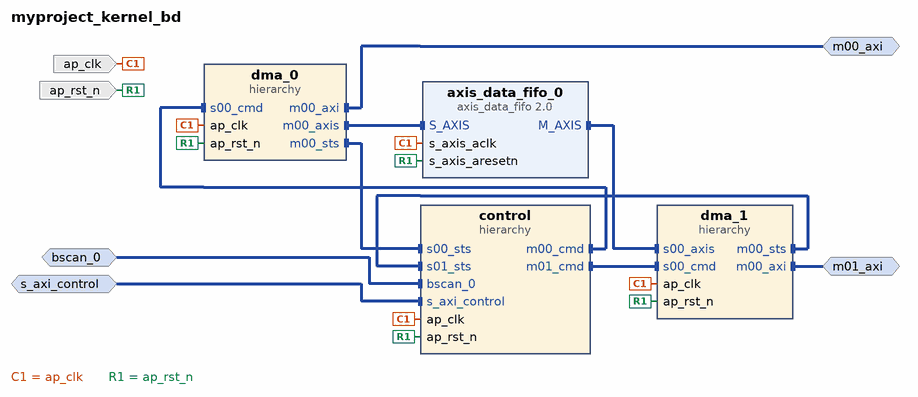
[diagram p0: block diagram of the top level]
# Vivado block design myproject_kernel_bd, xcu50-fsvh2104-2-e, Vivado 2020.1
create_bd_design myproject_kernel_bd

create_bd_intf_port -mode Slave -vlnv xilinx.com:interface:bscan_rtl:1.0 bscan_0
create_bd_intf_port -mode Master -vlnv xilinx.com:interface:aximm_rtl:1.0 m00_axi
set_property -dict [list \
  CONFIG.DATA_WIDTH 32 \
  CONFIG.PROTOCOL AXI4 \
  CONFIG.FREQ_HZ 250000000 \
  CONFIG.ADDR_WIDTH 64 \
  CONFIG.READ_WRITE_MODE READ_WRITE \
  CONFIG.HAS_BURST 0 \
  CONFIG.HAS_LOCK 0 \
  CONFIG.HAS_PROT 0 \
  CONFIG.HAS_CACHE 0 \
  CONFIG.HAS_QOS 0 \
  CONFIG.HAS_REGION 0 \
  CONFIG.HAS_WSTRB 1 \
  CONFIG.HAS_BRESP 0 \
  CONFIG.NUM_READ_OUTSTANDING 1 \
  CONFIG.NUM_WRITE_OUTSTANDING 1 \
] [get_bd_intf_ports m00_axi]
create_bd_intf_port -mode Master -vlnv xilinx.com:interface:aximm_rtl:1.0 m01_axi
set_property -dict [list \
  CONFIG.DATA_WIDTH 32 \
  CONFIG.PROTOCOL AXI4 \
  CONFIG.FREQ_HZ 250000000 \
  CONFIG.ADDR_WIDTH 64 \
  CONFIG.READ_WRITE_MODE READ_WRITE \
  CONFIG.HAS_BURST 0 \
  CONFIG.HAS_LOCK 0 \
  CONFIG.HAS_PROT 0 \
  CONFIG.HAS_CACHE 0 \
  CONFIG.HAS_QOS 0 \
  CONFIG.HAS_REGION 0 \
  CONFIG.HAS_WSTRB 1 \
  CONFIG.HAS_BRESP 0 \
  CONFIG.NUM_READ_OUTSTANDING 1 \
  CONFIG.NUM_WRITE_OUTSTANDING 1 \
] [get_bd_intf_ports m01_axi]
create_bd_intf_port -mode Slave -vlnv xilinx.com:interface:aximm_rtl:1.0 s_axi_control
set_property -dict [list \
  CONFIG.DATA_WIDTH 32 \
  CONFIG.PROTOCOL AXI4LITE \
  CONFIG.FREQ_HZ 250000000 \
  CONFIG.ID_WIDTH 0 \
  CONFIG.ADDR_WIDTH 12 \
  CONFIG.AWUSER_WIDTH 0 \
  CONFIG.ARUSER_WIDTH 0 \
  CONFIG.WUSER_WIDTH 0 \
  CONFIG.RUSER_WIDTH 0 \
  CONFIG.BUSER_WIDTH 0 \
  CONFIG.READ_WRITE_MODE READ_WRITE \
  CONFIG.HAS_BURST 0 \
  CONFIG.HAS_LOCK 0 \
  CONFIG.HAS_PROT 1 \
  CONFIG.HAS_CACHE 0 \
  CONFIG.HAS_QOS 0 \
  CONFIG.HAS_REGION 0 \
  CONFIG.HAS_WSTRB 1 \
  CONFIG.HAS_BRESP 1 \
  CONFIG.HAS_RRESP 1 \
  CONFIG.SUPPORTS_NARROW_BURST 0 \
  CONFIG.NUM_READ_OUTSTANDING 1 \
  CONFIG.NUM_WRITE_OUTSTANDING 1 \
  CONFIG.MAX_BURST_LENGTH 1 \
  CONFIG.NUM_READ_THREADS 1 \
  CONFIG.NUM_WRITE_THREADS 1 \
  CONFIG.RUSER_BITS_PER_BYTE 0 \
  CONFIG.WUSER_BITS_PER_BYTE 0 \
] [get_bd_intf_ports s_axi_control]
create_bd_port -dir I -type clk ap_clk
set_property -dict {CONFIG.ASSOCIATED_BUSIF m00_axi:m01_axi:s_axi_control CONFIG.FREQ_HZ 250000000} [get_bd_ports ap_clk]
create_bd_port -dir I -type rst ap_rst_n

create_bd_cell -type hier control
create_bd_cell -type hier dma_0
create_bd_cell -type hier dma_1
create_bd_cell -type ip -vlnv xilinx.com:ip:axis_data_fifo:2.0 axis_data_fifo_0
set_property -dict {CONFIG.FIFO_DEPTH 32768 CONFIG.HAS_TLAST 1 CONFIG.TDATA_NUM_BYTES 4} [get_bd_cells axis_data_fifo_0]

# ---- hierarchy /control ----
current_bd_instance /control
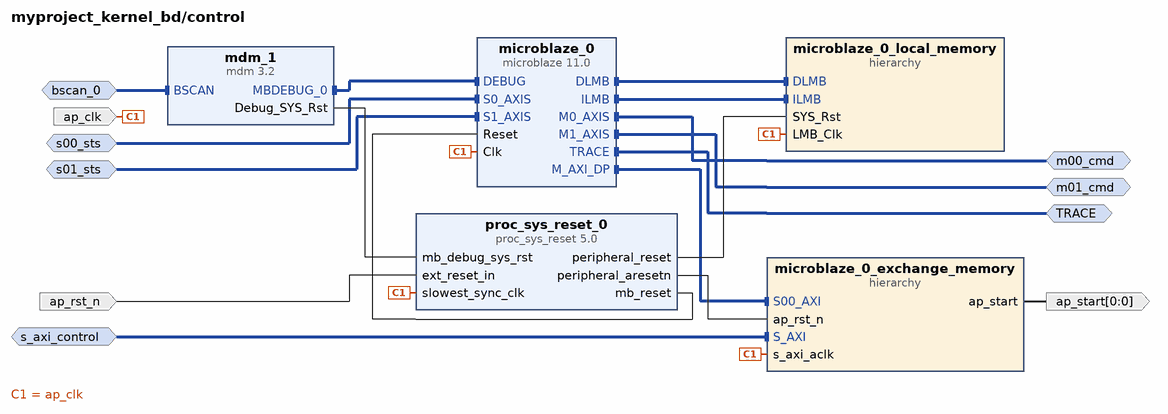
[diagram p1: block diagram inside /control]
create_bd_intf_pin -mode Master -vlnv xilinx.com:interface:mbtrace_rtl:2.0 TRACE
create_bd_intf_pin -mode Slave -vlnv xilinx.com:interface:bscan_rtl:1.0 bscan_0
create_bd_intf_pin -mode Master -vlnv xilinx.com:interface:axis_rtl:1.0 m00_cmd
create_bd_intf_pin -mode Slave -vlnv xilinx.com:interface:axis_rtl:1.0 s00_sts
create_bd_intf_pin -mode Master -vlnv xilinx.com:interface:axis_rtl:1.0 m01_cmd
create_bd_intf_pin -mode Slave -vlnv xilinx.com:interface:axis_rtl:1.0 s01_sts
create_bd_intf_pin -mode Slave -vlnv xilinx.com:interface:aximm_rtl:1.0 s_axi_control
create_bd_pin -dir I -type clk ap_clk
create_bd_pin -dir I -type rst ap_rst_n
create_bd_pin -dir O -from 0 -to 0 -type rst ap_start

create_bd_cell -type ip -vlnv xilinx.com:ip:mdm:3.2 mdm_1
set_property -dict {CONFIG.C_USE_BSCAN 2} [get_bd_cells mdm_1]
create_bd_cell -type ip -vlnv xilinx.com:ip:microblaze:11.0 microblaze_0
set_property -dict [list \
  CONFIG.C_BASE_VECTORS 0x0000000000010000 \
  CONFIG.C_DEBUG_ENABLED 1 \
  CONFIG.C_D_AXI 1 \
  CONFIG.C_D_LMB 1 \
  CONFIG.C_FSL_LINKS 2 \
  CONFIG.C_I_LMB 1 \
  CONFIG.C_TRACE 1 \
  CONFIG.C_USE_EXTENDED_FSL_INSTR 1 \
  CONFIG.C_USE_MSR_INSTR 1 \
  CONFIG.C_USE_PCMP_INSTR 1 \
] [get_bd_cells microblaze_0]
create_bd_cell -type hier microblaze_0_exchange_memory
create_bd_cell -type hier microblaze_0_local_memory
create_bd_cell -type ip -vlnv xilinx.com:ip:proc_sys_reset:5.0 proc_sys_reset_0

# ---- hierarchy /control/microblaze_0_exchange_memory ----
current_bd_instance /control/microblaze_0_exchange_memory
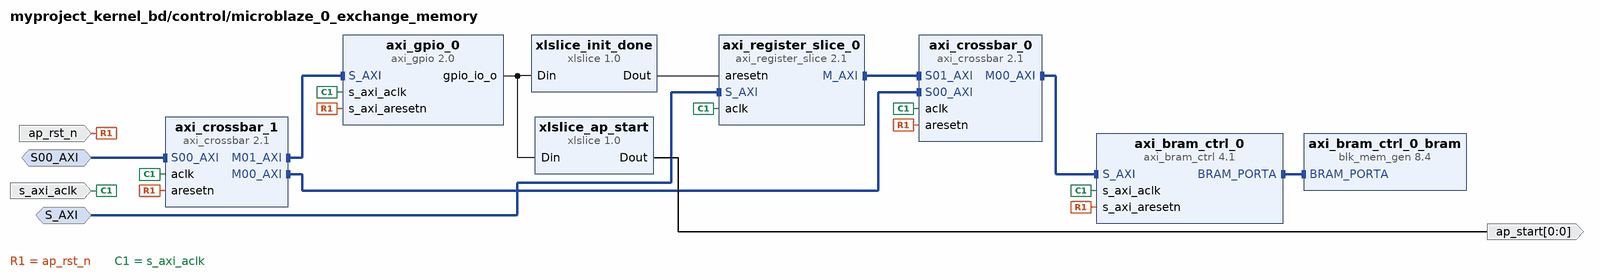
[diagram p2: block diagram inside /control/microblaze_0_exchange_memory]
create_bd_intf_pin -mode Slave -vlnv xilinx.com:interface:aximm_rtl:1.0 S00_AXI
create_bd_intf_pin -mode Slave -vlnv xilinx.com:interface:aximm_rtl:1.0 S_AXI
create_bd_pin -dir I -type rst ap_rst_n
create_bd_pin -dir O -from 0 -to 0 ap_start
create_bd_pin -dir I -type clk s_axi_aclk

create_bd_cell -type ip -vlnv xilinx.com:ip:axi_bram_ctrl:4.1 axi_bram_ctrl_0
set_property -dict {CONFIG.PROTOCOL AXI4LITE CONFIG.SINGLE_PORT_BRAM 1} [get_bd_cells axi_bram_ctrl_0]
create_bd_cell -type ip -vlnv xilinx.com:ip:axi_crossbar:2.1 axi_crossbar_0
set_property -dict {CONFIG.NUM_MI 1 CONFIG.NUM_SI 2 CONFIG.R_REGISTER 1} [get_bd_cells axi_crossbar_0]
create_bd_cell -type ip -vlnv xilinx.com:ip:axi_crossbar:2.1 axi_crossbar_1
set_property -dict {CONFIG.NUM_SI 1} [get_bd_cells axi_crossbar_1]
create_bd_cell -type ip -vlnv xilinx.com:ip:axi_gpio:2.0 axi_gpio_0
set_property -dict [list \
  CONFIG.C_ALL_INPUTS 0 \
  CONFIG.C_ALL_OUTPUTS 1 \
  CONFIG.C_GPIO_WIDTH 3 \
  CONFIG.C_INTERRUPT_PRESENT 0 \
  CONFIG.C_IS_DUAL 0 \
] [get_bd_cells axi_gpio_0]
create_bd_cell -type ip -vlnv xilinx.com:ip:axi_register_slice:2.1 axi_register_slice_0
set_property -dict {CONFIG.REG_B 7 CONFIG.REG_R 7 CONFIG.REG_W 7} [get_bd_cells axi_register_slice_0]
create_bd_cell -type ip -vlnv xilinx.com:ip:xlslice:1.0 xlslice_init_done
set_property -dict {CONFIG.DIN_FROM 0 CONFIG.DIN_TO 0 CONFIG.DIN_WIDTH 3} [get_bd_cells xlslice_init_done]
create_bd_cell -type ip -vlnv xilinx.com:ip:xlslice:1.0 xlslice_ap_start
set_property -dict {CONFIG.DIN_FROM 2 CONFIG.DIN_TO 2 CONFIG.DIN_WIDTH 3 CONFIG.DOUT_WIDTH 1} [get_bd_cells xlslice_ap_start]
create_bd_cell -type ip -vlnv xilinx.com:ip:blk_mem_gen:8.4 axi_bram_ctrl_0_bram

# ---- hierarchy /control/microblaze_0_local_memory ----
current_bd_instance /control/microblaze_0_local_memory
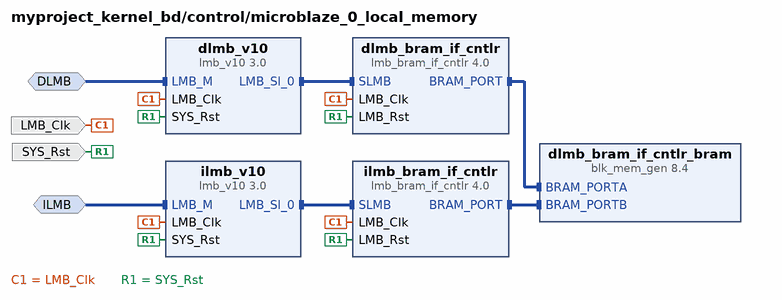
[diagram p3: block diagram inside /control/microblaze_0_local_memory]
create_bd_intf_pin -mode MirroredMaster -vlnv xilinx.com:interface:lmb_rtl:1.0 DLMB
create_bd_intf_pin -mode MirroredMaster -vlnv xilinx.com:interface:lmb_rtl:1.0 ILMB
create_bd_pin -dir I -type clk LMB_Clk
create_bd_pin -dir I -type rst SYS_Rst

create_bd_cell -type ip -vlnv xilinx.com:ip:lmb_bram_if_cntlr:4.0 dlmb_bram_if_cntlr
set_property -dict {CONFIG.C_ECC 0} [get_bd_cells dlmb_bram_if_cntlr]
create_bd_cell -type ip -vlnv xilinx.com:ip:lmb_v10:3.0 dlmb_v10
set_property -dict {CONFIG.C_LMB_NUM_SLAVES 2} [get_bd_cells dlmb_v10]
create_bd_cell -type ip -vlnv xilinx.com:ip:lmb_bram_if_cntlr:4.0 ilmb_bram_if_cntlr
set_property -dict {CONFIG.C_ECC 0} [get_bd_cells ilmb_bram_if_cntlr]
create_bd_cell -type ip -vlnv xilinx.com:ip:lmb_v10:3.0 ilmb_v10
create_bd_cell -type ip -vlnv xilinx.com:ip:blk_mem_gen:8.4 dlmb_bram_if_cntlr_bram
set_property -dict {CONFIG.Memory_Type True_Dual_Port_RAM} [get_bd_cells dlmb_bram_if_cntlr_bram]

# ---- hierarchy /dma_0 ----
current_bd_instance /dma_0
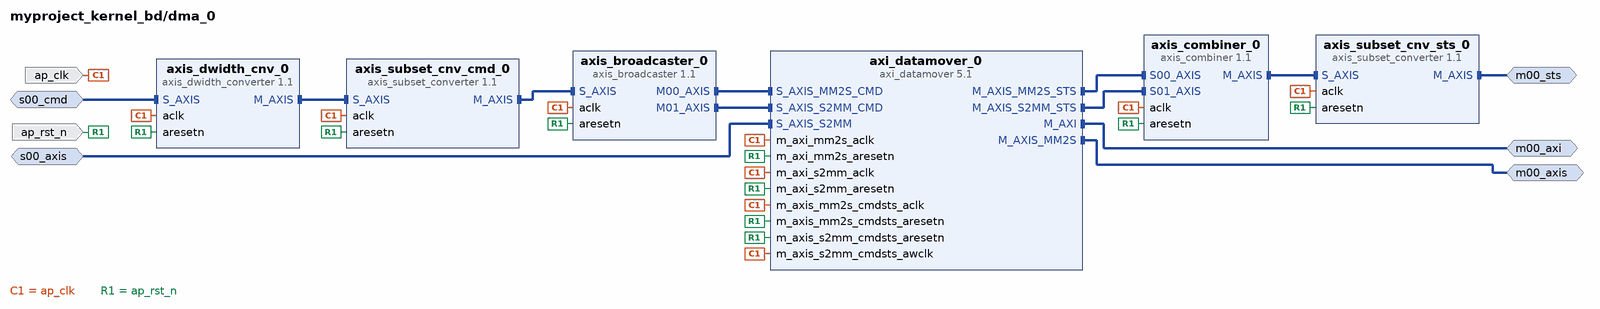
[diagram p4: block diagram inside /dma_0]
create_bd_intf_pin -mode Master -vlnv xilinx.com:interface:aximm_rtl:1.0 m00_axi
create_bd_intf_pin -mode Master -vlnv xilinx.com:interface:axis_rtl:1.0 m00_axis
create_bd_intf_pin -mode Master -vlnv xilinx.com:interface:axis_rtl:1.0 m00_sts
create_bd_intf_pin -mode Slave -vlnv xilinx.com:interface:axis_rtl:1.0 s00_axis
create_bd_intf_pin -mode Slave -vlnv xilinx.com:interface:axis_rtl:1.0 s00_cmd
create_bd_pin -dir I -type clk ap_clk
create_bd_pin -dir I -type rst ap_rst_n

create_bd_cell -type ip -vlnv xilinx.com:ip:axi_datamover:5.1 axi_datamover_0
set_property -dict [list \
  CONFIG.c_addr_width 64 \
  CONFIG.c_dummy 0 \
  CONFIG.c_enable_mm2s 1 \
  CONFIG.c_include_mm2s Full \
  CONFIG.c_include_mm2s_stsfifo true \
  CONFIG.c_m_axi_mm2s_data_width 32 \
  CONFIG.c_m_axi_mm2s_id_width 0 \
  CONFIG.c_m_axi_s2mm_data_width 32 \
  CONFIG.c_m_axi_s2mm_id_width 0 \
  CONFIG.c_m_axis_mm2s_tdata_width 32 \
  CONFIG.c_mm2s_btt_used 23 \
  CONFIG.c_mm2s_burst_size 256 \
  CONFIG.c_mm2s_include_sf false \
  CONFIG.c_s2mm_btt_used 23 \
  CONFIG.c_s2mm_burst_size 256 \
  CONFIG.c_s_axis_s2mm_tdata_width 32 \
  CONFIG.c_single_interface 1 \
] [get_bd_cells axi_datamover_0]
create_bd_cell -type ip -vlnv xilinx.com:ip:axis_broadcaster:1.1 axis_broadcaster_0
create_bd_cell -type ip -vlnv xilinx.com:ip:axis_combiner:1.1 axis_combiner_0
create_bd_cell -type ip -vlnv xilinx.com:ip:axis_dwidth_converter:1.1 axis_dwidth_cnv_0
set_property -dict [list \
  CONFIG.HAS_MI_TKEEP 0 \
  CONFIG.HAS_TLAST 0 \
  CONFIG.M_TDATA_NUM_BYTES 16 \
  CONFIG.S_TDATA_NUM_BYTES 4 \
] [get_bd_cells axis_dwidth_cnv_0]
create_bd_cell -type ip -vlnv xilinx.com:ip:axis_subset_converter:1.1 axis_subset_cnv_cmd_0
set_property -dict [list \
  CONFIG.M_TDATA_NUM_BYTES 13 \
  CONFIG.S_TDATA_NUM_BYTES 16 \
  CONFIG.TDATA_REMAP {tdata[103:0]} \
] [get_bd_cells axis_subset_cnv_cmd_0]
create_bd_cell -type ip -vlnv xilinx.com:ip:axis_subset_converter:1.1 axis_subset_cnv_sts_0
set_property -dict [list \
  CONFIG.M_HAS_TKEEP 0 \
  CONFIG.M_TDATA_NUM_BYTES 4 \
  CONFIG.S_TDATA_NUM_BYTES 2 \
  CONFIG.TDATA_REMAP {16'b0000000000000000,tdata[15:0]} \
] [get_bd_cells axis_subset_cnv_sts_0]

# ---- hierarchy /dma_1 ----
current_bd_instance /dma_1
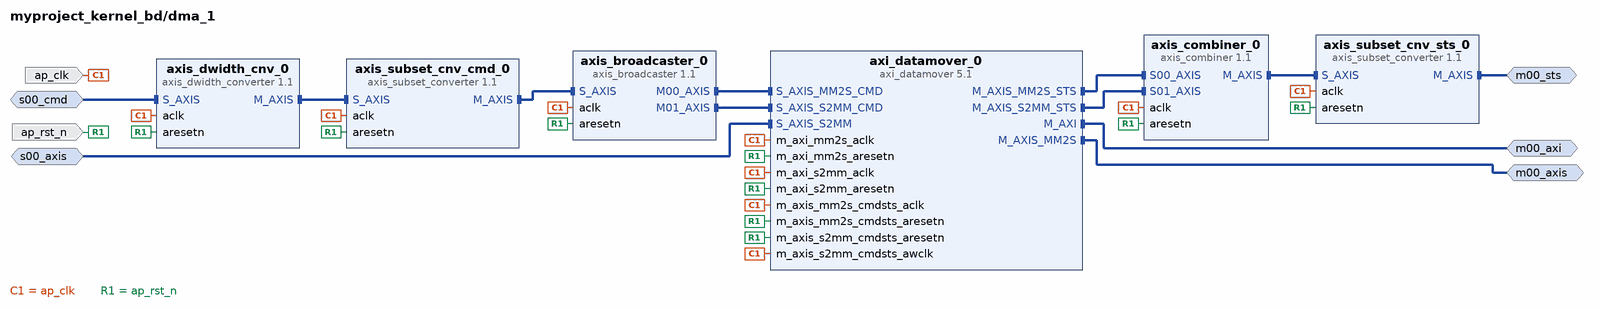
[diagram p5: block diagram inside /dma_1]
create_bd_intf_pin -mode Master -vlnv xilinx.com:interface:aximm_rtl:1.0 m00_axi
create_bd_intf_pin -mode Master -vlnv xilinx.com:interface:axis_rtl:1.0 m00_axis
create_bd_intf_pin -mode Master -vlnv xilinx.com:interface:axis_rtl:1.0 m00_sts
create_bd_intf_pin -mode Slave -vlnv xilinx.com:interface:axis_rtl:1.0 s00_axis
create_bd_intf_pin -mode Slave -vlnv xilinx.com:interface:axis_rtl:1.0 s00_cmd
create_bd_pin -dir I -type clk ap_clk
create_bd_pin -dir I -type rst ap_rst_n

create_bd_cell -type ip -vlnv xilinx.com:ip:axi_datamover:5.1 axi_datamover_0
set_property -dict [list \
  CONFIG.c_addr_width 64 \
  CONFIG.c_dummy 0 \
  CONFIG.c_enable_mm2s 1 \
  CONFIG.c_include_mm2s Full \
  CONFIG.c_include_mm2s_stsfifo true \
  CONFIG.c_m_axi_mm2s_data_width 32 \
  CONFIG.c_m_axi_mm2s_id_width 0 \
  CONFIG.c_m_axi_s2mm_data_width 32 \
  CONFIG.c_m_axi_s2mm_id_width 0 \
  CONFIG.c_m_axis_mm2s_tdata_width 32 \
  CONFIG.c_mm2s_btt_used 23 \
  CONFIG.c_mm2s_burst_size 256 \
  CONFIG.c_mm2s_include_sf false \
  CONFIG.c_s2mm_btt_used 23 \
  CONFIG.c_s2mm_burst_size 256 \
  CONFIG.c_s_axis_s2mm_tdata_width 32 \
  CONFIG.c_single_interface 1 \
] [get_bd_cells axi_datamover_0]
create_bd_cell -type ip -vlnv xilinx.com:ip:axis_broadcaster:1.1 axis_broadcaster_0
create_bd_cell -type ip -vlnv xilinx.com:ip:axis_combiner:1.1 axis_combiner_0
create_bd_cell -type ip -vlnv xilinx.com:ip:axis_dwidth_converter:1.1 axis_dwidth_cnv_0
set_property -dict [list \
  CONFIG.HAS_MI_TKEEP 0 \
  CONFIG.HAS_TLAST 0 \
  CONFIG.M_TDATA_NUM_BYTES 16 \
  CONFIG.S_TDATA_NUM_BYTES 4 \
] [get_bd_cells axis_dwidth_cnv_0]
create_bd_cell -type ip -vlnv xilinx.com:ip:axis_subset_converter:1.1 axis_subset_cnv_cmd_0
set_property -dict [list \
  CONFIG.M_TDATA_NUM_BYTES 13 \
  CONFIG.S_TDATA_NUM_BYTES 16 \
  CONFIG.TDATA_REMAP {tdata[103:0]} \
] [get_bd_cells axis_subset_cnv_cmd_0]
create_bd_cell -type ip -vlnv xilinx.com:ip:axis_subset_converter:1.1 axis_subset_cnv_sts_0
set_property -dict [list \
  CONFIG.M_HAS_TKEEP 0 \
  CONFIG.M_TDATA_NUM_BYTES 4 \
  CONFIG.S_TDATA_NUM_BYTES 2 \
  CONFIG.TDATA_REMAP {16'b0000000000000000,tdata[15:0]} \
] [get_bd_cells axis_subset_cnv_sts_0]

# ---- connections ----

current_bd_instance /control
connect_bd_intf_net [get_bd_intf_pins s_axi_control] [get_bd_intf_pins microblaze_0_exchange_memory/S_AXI]
connect_bd_intf_net [get_bd_intf_pins bscan_0] [get_bd_intf_pins mdm_1/BSCAN]
connect_bd_intf_net [get_bd_intf_pins m00_cmd] [get_bd_intf_pins microblaze_0/M0_AXIS]
connect_bd_intf_net [get_bd_intf_pins m01_cmd] [get_bd_intf_pins microblaze_0/M1_AXIS]
connect_bd_intf_net [get_bd_intf_pins microblaze_0/M_AXI_DP] [get_bd_intf_pins microblaze_0_exchange_memory/S00_AXI]
connect_bd_intf_net [get_bd_intf_pins TRACE] [get_bd_intf_pins microblaze_0/TRACE]
connect_bd_intf_net [get_bd_intf_pins mdm_1/MBDEBUG_0] [get_bd_intf_pins microblaze_0/DEBUG]
connect_bd_intf_net [get_bd_intf_pins microblaze_0/DLMB] [get_bd_intf_pins microblaze_0_local_memory/DLMB]
connect_bd_intf_net [get_bd_intf_pins microblaze_0/ILMB] [get_bd_intf_pins microblaze_0_local_memory/ILMB]
connect_bd_intf_net [get_bd_intf_pins s00_sts] [get_bd_intf_pins microblaze_0/S0_AXIS]
connect_bd_intf_net [get_bd_intf_pins s01_sts] [get_bd_intf_pins microblaze_0/S1_AXIS]
connect_bd_net -net microblaze_0_exchange_memory_Dout [get_bd_pins microblaze_0_exchange_memory/ap_start] [get_bd_pins ap_start]
connect_bd_net -net SYS_Rst_1 [get_bd_pins proc_sys_reset_0/peripheral_reset] [get_bd_pins microblaze_0_local_memory/SYS_Rst]
connect_bd_net [get_bd_pins ap_clk] \
  [get_bd_pins microblaze_0/Clk] [get_bd_pins microblaze_0_exchange_memory/s_axi_aclk] \
  [get_bd_pins microblaze_0_local_memory/LMB_Clk] [get_bd_pins proc_sys_reset_0/slowest_sync_clk]
connect_bd_net [get_bd_pins ap_rst_n] [get_bd_pins proc_sys_reset_0/ext_reset_in]
connect_bd_net -net ap_rst_n_1 [get_bd_pins proc_sys_reset_0/peripheral_aresetn] [get_bd_pins microblaze_0_exchange_memory/ap_rst_n]
connect_bd_net [get_bd_pins mdm_1/Debug_SYS_Rst] [get_bd_pins proc_sys_reset_0/mb_debug_sys_rst]
connect_bd_net [get_bd_pins proc_sys_reset_0/mb_reset] [get_bd_pins microblaze_0/Reset]
set_property HDL_ATTRIBUTE.BMM_INFO_PROCESSOR {microblaze-le > myproject_kernel_bd control/microblaze_0_local_memory/dlmb_bram_if_cntlr myproject_kernel_bd control/microblaze_0_exchange_memory/axi_bram_ctrl_0} [get_bd_cells microblaze_0]
set_property HDL_ATTRIBUTE.KEEP_HIERARCHY yes [get_bd_cells microblaze_0]

current_bd_instance /control/microblaze_0_exchange_memory
connect_bd_intf_net [get_bd_intf_pins axi_bram_ctrl_0_bram/BRAM_PORTA] [get_bd_intf_pins axi_bram_ctrl_0/BRAM_PORTA]
connect_bd_intf_net [get_bd_intf_pins axi_crossbar_0/S01_AXI] [get_bd_intf_pins axi_register_slice_0/M_AXI]
connect_bd_intf_net [get_bd_intf_pins S_AXI] [get_bd_intf_pins axi_register_slice_0/S_AXI]
connect_bd_intf_net [get_bd_intf_pins S00_AXI] [get_bd_intf_pins axi_crossbar_1/S00_AXI]
connect_bd_intf_net [get_bd_intf_pins axi_bram_ctrl_0/S_AXI] [get_bd_intf_pins axi_crossbar_0/M00_AXI]
connect_bd_intf_net [get_bd_intf_pins axi_crossbar_0/S00_AXI] [get_bd_intf_pins axi_crossbar_1/M00_AXI]
connect_bd_intf_net [get_bd_intf_pins axi_crossbar_1/M01_AXI] [get_bd_intf_pins axi_gpio_0/S_AXI]
connect_bd_net [get_bd_pins ap_rst_n] \
  [get_bd_pins axi_bram_ctrl_0/s_axi_aresetn] [get_bd_pins axi_gpio_0/s_axi_aresetn] [get_bd_pins axi_crossbar_0/aresetn] \
  [get_bd_pins axi_crossbar_1/aresetn]
connect_bd_net [get_bd_pins axi_gpio_0/gpio_io_o] [get_bd_pins xlslice_ap_start/Din] [get_bd_pins xlslice_init_done/Din]
connect_bd_net [get_bd_pins s_axi_aclk] \
  [get_bd_pins axi_bram_ctrl_0/s_axi_aclk] [get_bd_pins axi_gpio_0/s_axi_aclk] [get_bd_pins axi_register_slice_0/aclk] \
  [get_bd_pins axi_crossbar_0/aclk] [get_bd_pins axi_crossbar_1/aclk]
connect_bd_net -net xlslice_init_done [get_bd_pins xlslice_init_done/Dout] [get_bd_pins axi_register_slice_0/aresetn]
connect_bd_net [get_bd_pins xlslice_ap_start/Dout] [get_bd_pins ap_start]
set_property HDL_ATTRIBUTE.BMM_INFO_ADDRESS_SPACE {byte  0x00000000 32 > myproject_kernel_bd control/microblaze_0_exchange_memory/axi_bram_ctrl_0_bram} [get_bd_cells axi_bram_ctrl_0]
set_property HDL_ATTRIBUTE.KEEP_HIERARCHY yes [get_bd_cells axi_bram_ctrl_0]

current_bd_instance /control/microblaze_0_local_memory
connect_bd_intf_net [get_bd_intf_pins dlmb_bram_if_cntlr_bram/BRAM_PORTB] [get_bd_intf_pins ilmb_bram_if_cntlr/BRAM_PORT]
connect_bd_intf_net [get_bd_intf_pins DLMB] [get_bd_intf_pins dlmb_v10/LMB_M]
connect_bd_intf_net [get_bd_intf_pins ILMB] [get_bd_intf_pins ilmb_v10/LMB_M]
connect_bd_intf_net [get_bd_intf_pins ilmb_bram_if_cntlr/SLMB] [get_bd_intf_pins ilmb_v10/LMB_Sl_0]
connect_bd_intf_net [get_bd_intf_pins dlmb_bram_if_cntlr/SLMB] [get_bd_intf_pins dlmb_v10/LMB_Sl_0]
connect_bd_intf_net [get_bd_intf_pins dlmb_bram_if_cntlr_bram/BRAM_PORTA] [get_bd_intf_pins dlmb_bram_if_cntlr/BRAM_PORT]
connect_bd_net -net microblaze_0_Clk [get_bd_pins LMB_Clk] \
  [get_bd_pins dlmb_bram_if_cntlr/LMB_Clk] [get_bd_pins dlmb_v10/LMB_Clk] [get_bd_pins ilmb_bram_if_cntlr/LMB_Clk] \
  [get_bd_pins ilmb_v10/LMB_Clk]
connect_bd_net -net microblaze_0_LMB_Rst [get_bd_pins SYS_Rst] \
  [get_bd_pins dlmb_bram_if_cntlr/LMB_Rst] [get_bd_pins dlmb_v10/SYS_Rst] [get_bd_pins ilmb_bram_if_cntlr/LMB_Rst] \
  [get_bd_pins ilmb_v10/SYS_Rst]
set_property HDL_ATTRIBUTE.BMM_INFO_ADDRESS_SPACE {byte  0x00010000 32 > myproject_kernel_bd control/microblaze_0_local_memory/dlmb_bram_if_cntlr_bram} [get_bd_cells dlmb_bram_if_cntlr]
set_property HDL_ATTRIBUTE.KEEP_HIERARCHY yes [get_bd_cells dlmb_bram_if_cntlr]

current_bd_instance /dma_0
connect_bd_intf_net [get_bd_intf_pins axis_dwidth_cnv_0/M_AXIS] [get_bd_intf_pins axis_subset_cnv_cmd_0/S_AXIS]
connect_bd_intf_net [get_bd_intf_pins s00_cmd] [get_bd_intf_pins axis_dwidth_cnv_0/S_AXIS]
connect_bd_intf_net [get_bd_intf_pins m00_sts] [get_bd_intf_pins axis_subset_cnv_sts_0/M_AXIS]
connect_bd_intf_net [get_bd_intf_pins axis_broadcaster_0/S_AXIS] [get_bd_intf_pins axis_subset_cnv_cmd_0/M_AXIS]
connect_bd_intf_net [get_bd_intf_pins s00_axis] [get_bd_intf_pins axi_datamover_0/S_AXIS_S2MM]
connect_bd_intf_net [get_bd_intf_pins m00_axi] [get_bd_intf_pins axi_datamover_0/M_AXI]
connect_bd_intf_net [get_bd_intf_pins m00_axis] [get_bd_intf_pins axi_datamover_0/M_AXIS_MM2S]
connect_bd_intf_net [get_bd_intf_pins axi_datamover_0/M_AXIS_MM2S_STS] [get_bd_intf_pins axis_combiner_0/S00_AXIS]
connect_bd_intf_net [get_bd_intf_pins axi_datamover_0/M_AXIS_S2MM_STS] [get_bd_intf_pins axis_combiner_0/S01_AXIS]
connect_bd_intf_net [get_bd_intf_pins axi_datamover_0/S_AXIS_MM2S_CMD] [get_bd_intf_pins axis_broadcaster_0/M00_AXIS]
connect_bd_intf_net [get_bd_intf_pins axi_datamover_0/S_AXIS_S2MM_CMD] [get_bd_intf_pins axis_broadcaster_0/M01_AXIS]
connect_bd_intf_net [get_bd_intf_pins axis_combiner_0/M_AXIS] [get_bd_intf_pins axis_subset_cnv_sts_0/S_AXIS]
connect_bd_net [get_bd_pins ap_clk] \
  [get_bd_pins axi_datamover_0/m_axi_mm2s_aclk] [get_bd_pins axi_datamover_0/m_axi_s2mm_aclk] \
  [get_bd_pins axi_datamover_0/m_axis_mm2s_cmdsts_aclk] [get_bd_pins axi_datamover_0/m_axis_s2mm_cmdsts_awclk] \
  [get_bd_pins axis_broadcaster_0/aclk] [get_bd_pins axis_combiner_0/aclk] [get_bd_pins axis_dwidth_cnv_0/aclk] \
  [get_bd_pins axis_subset_cnv_cmd_0/aclk] [get_bd_pins axis_subset_cnv_sts_0/aclk]
connect_bd_net [get_bd_pins ap_rst_n] \
  [get_bd_pins axi_datamover_0/m_axi_mm2s_aresetn] [get_bd_pins axi_datamover_0/m_axi_s2mm_aresetn] \
  [get_bd_pins axi_datamover_0/m_axis_mm2s_cmdsts_aresetn] [get_bd_pins axi_datamover_0/m_axis_s2mm_cmdsts_aresetn] \
  [get_bd_pins axis_broadcaster_0/aresetn] [get_bd_pins axis_combiner_0/aresetn] [get_bd_pins axis_dwidth_cnv_0/aresetn] \
  [get_bd_pins axis_subset_cnv_cmd_0/aresetn] [get_bd_pins axis_subset_cnv_sts_0/aresetn]

current_bd_instance /dma_1
connect_bd_intf_net [get_bd_intf_pins m00_axi] [get_bd_intf_pins axi_datamover_0/M_AXI]
connect_bd_intf_net [get_bd_intf_pins m00_axis] [get_bd_intf_pins axi_datamover_0/M_AXIS_MM2S]
connect_bd_intf_net [get_bd_intf_pins axi_datamover_0/M_AXIS_MM2S_STS] [get_bd_intf_pins axis_combiner_0/S00_AXIS]
connect_bd_intf_net [get_bd_intf_pins axi_datamover_0/M_AXIS_S2MM_STS] [get_bd_intf_pins axis_combiner_0/S01_AXIS]
connect_bd_intf_net [get_bd_intf_pins axi_datamover_0/S_AXIS_MM2S_CMD] [get_bd_intf_pins axis_broadcaster_0/M00_AXIS]
connect_bd_intf_net [get_bd_intf_pins axi_datamover_0/S_AXIS_S2MM_CMD] [get_bd_intf_pins axis_broadcaster_0/M01_AXIS]
connect_bd_intf_net [get_bd_intf_pins axis_combiner_0/M_AXIS] [get_bd_intf_pins axis_subset_cnv_sts_0/S_AXIS]
connect_bd_intf_net [get_bd_intf_pins axis_dwidth_cnv_0/M_AXIS] [get_bd_intf_pins axis_subset_cnv_cmd_0/S_AXIS]
connect_bd_intf_net [get_bd_intf_pins s00_cmd] [get_bd_intf_pins axis_dwidth_cnv_0/S_AXIS]
connect_bd_intf_net [get_bd_intf_pins m00_sts] [get_bd_intf_pins axis_subset_cnv_sts_0/M_AXIS]
connect_bd_intf_net [get_bd_intf_pins axis_broadcaster_0/S_AXIS] [get_bd_intf_pins axis_subset_cnv_cmd_0/M_AXIS]
connect_bd_intf_net [get_bd_intf_pins s00_axis] [get_bd_intf_pins axi_datamover_0/S_AXIS_S2MM]
connect_bd_net [get_bd_pins ap_clk] \
  [get_bd_pins axi_datamover_0/m_axi_mm2s_aclk] [get_bd_pins axi_datamover_0/m_axi_s2mm_aclk] \
  [get_bd_pins axi_datamover_0/m_axis_mm2s_cmdsts_aclk] [get_bd_pins axi_datamover_0/m_axis_s2mm_cmdsts_awclk] \
  [get_bd_pins axis_broadcaster_0/aclk] [get_bd_pins axis_combiner_0/aclk] [get_bd_pins axis_dwidth_cnv_0/aclk] \
  [get_bd_pins axis_subset_cnv_cmd_0/aclk] [get_bd_pins axis_subset_cnv_sts_0/aclk]
connect_bd_net [get_bd_pins ap_rst_n] \
  [get_bd_pins axi_datamover_0/m_axi_mm2s_aresetn] [get_bd_pins axi_datamover_0/m_axi_s2mm_aresetn] \
  [get_bd_pins axi_datamover_0/m_axis_mm2s_cmdsts_aresetn] [get_bd_pins axi_datamover_0/m_axis_s2mm_cmdsts_aresetn] \
  [get_bd_pins axis_broadcaster_0/aresetn] [get_bd_pins axis_combiner_0/aresetn] [get_bd_pins axis_dwidth_cnv_0/aresetn] \
  [get_bd_pins axis_subset_cnv_cmd_0/aresetn] [get_bd_pins axis_subset_cnv_sts_0/aresetn]

current_bd_instance /
connect_bd_intf_net [get_bd_intf_pins axis_data_fifo_0/M_AXIS] [get_bd_intf_pins dma_1/s00_axis]
connect_bd_intf_net [get_bd_intf_pins control/s00_sts] [get_bd_intf_pins dma_0/m00_sts]
connect_bd_intf_net [get_bd_intf_pins axis_data_fifo_0/S_AXIS] [get_bd_intf_pins dma_0/m00_axis]
connect_bd_intf_net [get_bd_intf_ports bscan_0] [get_bd_intf_pins control/bscan_0]
connect_bd_intf_net [get_bd_intf_pins control/m00_cmd] [get_bd_intf_pins dma_0/s00_cmd]
connect_bd_intf_net [get_bd_intf_ports m00_axi] [get_bd_intf_pins dma_0/m00_axi]
connect_bd_intf_net [get_bd_intf_pins control/m01_cmd] [get_bd_intf_pins dma_1/s00_cmd]
connect_bd_intf_net [get_bd_intf_ports m01_axi] [get_bd_intf_pins dma_1/m00_axi]
connect_bd_intf_net [get_bd_intf_pins control/s01_sts] [get_bd_intf_pins dma_1/m00_sts]
connect_bd_intf_net [get_bd_intf_ports s_axi_control] [get_bd_intf_pins control/s_axi_control]
connect_bd_net [get_bd_ports ap_clk] \
  [get_bd_pins control/ap_clk] [get_bd_pins dma_0/ap_clk] [get_bd_pins dma_1/ap_clk] \
  [get_bd_pins axis_data_fifo_0/s_axis_aclk]
connect_bd_net [get_bd_ports ap_rst_n] \
  [get_bd_pins control/ap_rst_n] [get_bd_pins dma_0/ap_rst_n] [get_bd_pins dma_1/ap_rst_n] \
  [get_bd_pins axis_data_fifo_0/s_axis_aresetn]

# ---- address map ----
assign_bd_address -offset 0x00000000 -range 4K -target_address_space [get_bd_addr_spaces control/microblaze_0/Data] [get_bd_addr_segs control/microblaze_0_exchange_memory/axi_bram_ctrl_0/S_AXI/Mem0]
assign_bd_address -offset 0x00010000 -range 16K -target_address_space [get_bd_addr_spaces control/microblaze_0/Data] [get_bd_addr_segs control/microblaze_0_local_memory/dlmb_bram_if_cntlr/SLMB/Mem]
assign_bd_address -offset 0x40000000 -range 4K -target_address_space [get_bd_addr_spaces control/microblaze_0/Data] [get_bd_addr_segs control/microblaze_0_exchange_memory/axi_gpio_0/S_AXI/Reg]
assign_bd_address -offset 0x00010000 -range 16K -target_address_space [get_bd_addr_spaces control/microblaze_0/Instruction] [get_bd_addr_segs control/microblaze_0_local_memory/ilmb_bram_if_cntlr/SLMB/Mem]
assign_bd_address -offset 0x0000000000000000 -range 16E -target_address_space [get_bd_addr_spaces dma_0/axi_datamover_0/Data] [get_bd_addr_segs m00_axi/Reg]
assign_bd_address -offset 0x0000000000000000 -range 16E -target_address_space [get_bd_addr_spaces dma_1/axi_datamover_0/Data] [get_bd_addr_segs m01_axi/Reg]
assign_bd_address -offset 0x000 -range 4K -target_address_space [get_bd_addr_spaces s_axi_control] [get_bd_addr_segs control/microblaze_0_exchange_memory/axi_bram_ctrl_0/S_AXI/Mem0]

validate_bd_design
save_bd_design
